# Altium schematic sheet Misc.SchDoc
size A4 portrait; CompanyName: FairWaves LLC; DrawnBy: Andrey Sviyazov; DocumentNumber: 2; Revision: 1; SheetNumber: 2; SheetTotal: 5
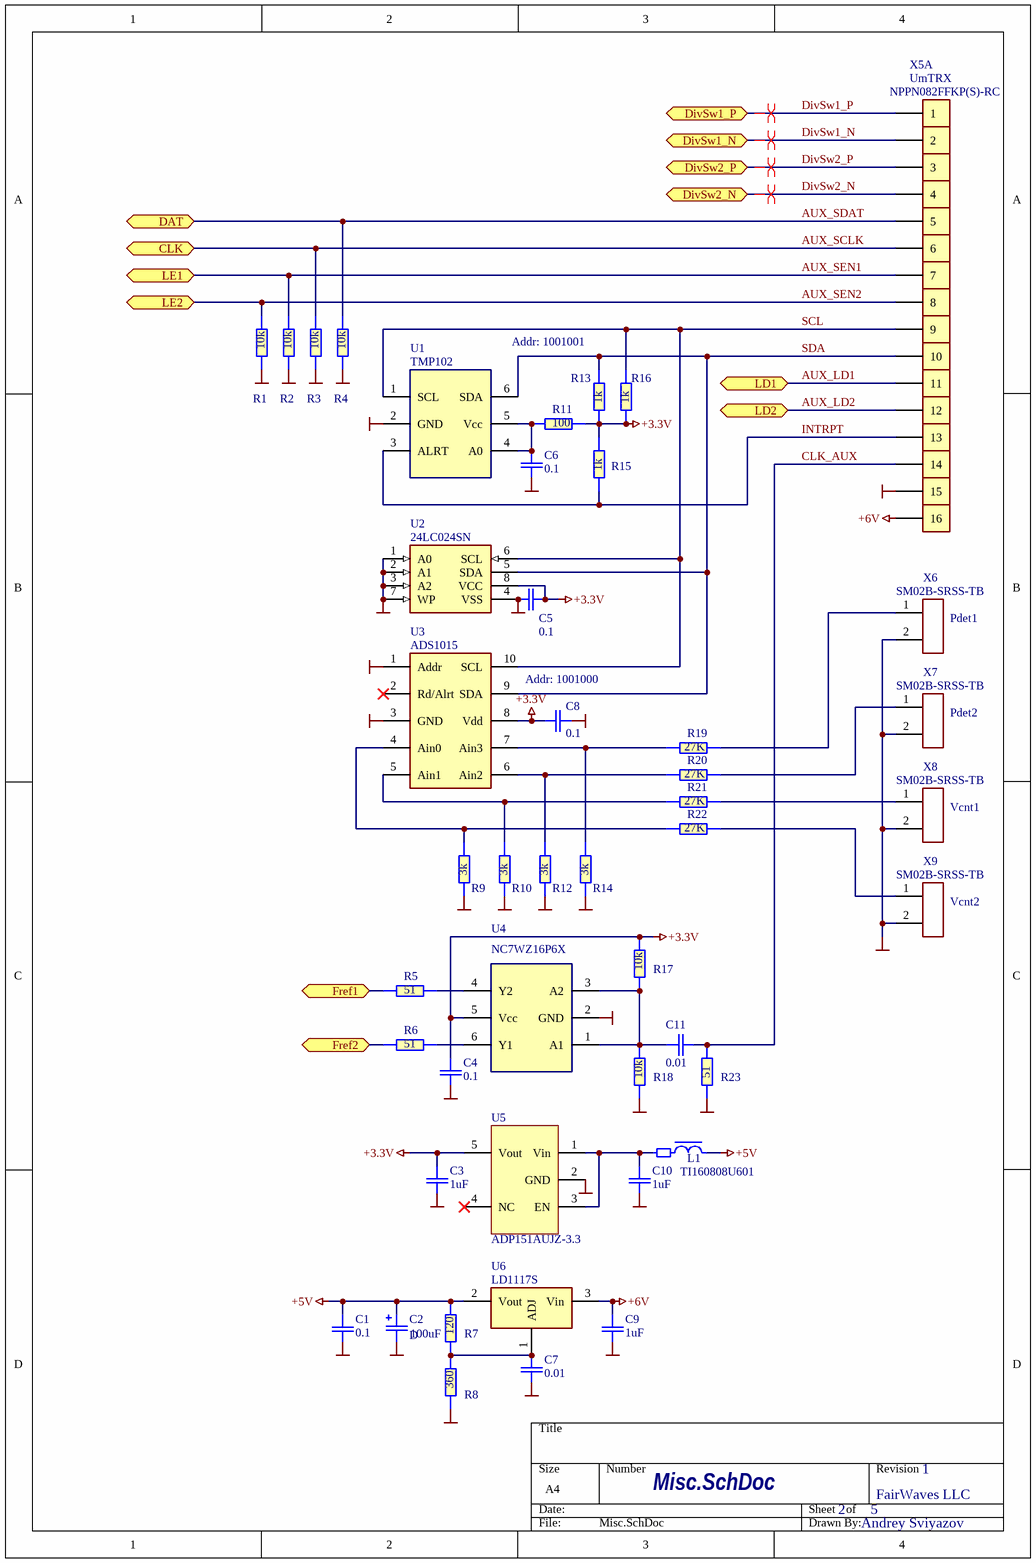
[diagram p0: Misc.SchDoc]

## Parts
C1  0.1  [C0603-Phillips]
C2  100uF  [cd7343]
C3  1uF  [C0603-Phillips]
C4  0.1  [C0603-Phillips]
C5  0.1  [C0603-Phillips]
C6  0.1  [C0603-Phillips]
C7  0.01  [C0603-Phillips]
C8  0.1  [C0603-Phillips]
C9  1uF  [C0603-Phillips]
C10  1uF  [C0603-Phillips]
C11  0.01  [C0603-Phillips]
L1  TI160808U601  [Ti160808-Phillips]
R1  10k  [R0603-PHILLIPS]
R2  10k  [R0603-PHILLIPS]
R3  10k  [R0603-PHILLIPS]
R4  10k  [R0603-PHILLIPS]
R5  51  [R0603-PHILLIPS]
R6  51  [R0603-PHILLIPS]
R7  120  [R0603-PHILLIPS]
R8  360  [R0603-PHILLIPS]
R9  3k  [R0603-PHILLIPS]
R10  3k  [R0603-PHILLIPS]
R11  100  [R0603-PHILLIPS]
R12  3k  [R0603-PHILLIPS]
R13  1k  [R0603-PHILLIPS]
R14  3k  [R0603-PHILLIPS]
R15  1k  [R0603-PHILLIPS]
R16  1k  [R0603-PHILLIPS]
R17  10k  [R0603-PHILLIPS]
R18  10k  [R0603-PHILLIPS]
R19  27K  [R0603-PHILLIPS]
R20  27K  [R0603-PHILLIPS]
R21  27K  [R0603-PHILLIPS]
R22  27K  [R0603-PHILLIPS]
R23  51  [R0603-PHILLIPS]
U1  TMP102  Addr: 1001001  [PDSO-G6]
U2  24LC024SN  [SOIC8]
U3  ADS1015  Addr: 1001000  [TSSOP-SPDSO-G10]
U4  NC7WZ16P6X  [SC70-6LD(SOT363)]
U5  ADP151AUJZ-3.3  [SOT-23-5[3.1x1.8/0.95]]
U6  LD1117S  [SOT-223-1]
X5  NPPN082FFKP(S)-RC  Misc: UmTRX  [NPPN082FFKP(S)]  (parts A,B,C,D,E,F,G,H,I,J,K,L,M,N,O,P of 16)
X6  SM02B-SRSS-TB  Misc: Pdet1  [SM02B-SRSS-TB]
X7  SM02B-SRSS-TB  Misc: Pdet2  [SM02B-SRSS-TB]
X8  SM02B-SRSS-TB  Misc: Vcnt1  [SM02B-SRSS-TB]
X9  SM02B-SRSS-TB  Misc: Vcnt2  [SM02B-SRSS-TB]

## Ports
CLK, DAT, DivSw1_N, DivSw1_P, DivSw2_N, DivSw2_P, Fref1, Fref2, LD1, LD2, LE1, LE2

## Nets
+3.3V: C3.2 C4.2 C5.2 C8.1 R11.2 R13.1 R15.2 R16.1 R17.1 U2.8(VCC) U3.8(Vdd) U4.5(Vcc) U5.5(Vout)
+5V: C1.2 C2.1(+) L1.1 R7.1 U6.2(Vout)
+6V: C9.2 U6.3(Vin) X5.16
GND: C1.1 C2.2(-) C3.1 C4.1 C5.1 C6.1 C7.1 C8.2 C9.1 C10.1 R1.1 R2.1 R3.1 R4.1 R8.2 R9.2 R10.2 R12.2 R14.2 R18.2 R23.2 U1.2(GND) U2.1(A0) U2.2(A1) U2.3(A2) U2.4(VSS) U2.7(WP) U3.1(Addr) U3.3(GND) U4.2(GND) U5.2(GND) X5.15 X6.2 X7.2 X8.2 X9.2
AUX_LD1: X5.11 ; port LD1
AUX_LD2: X5.12 ; port LD2
AUX_SCLK: R3.2 X5.6 ; port CLK
AUX_SDAT: R4.2 X5.5 ; port DAT
AUX_SEN1: R2.2 X5.7 ; port LE1
AUX_SEN2: R1.2 X5.8 ; port LE2
CLK_AUX: C11.1 R23.1 X5.14
DivSw1_N: X5.2 ; port DivSw1_N
DivSw1_P: X5.1 ; port DivSw1_P
DivSw2_N: X5.4 ; port DivSw2_N
DivSw2_P: X5.3 ; port DivSw2_P
Fref1: R5.1 ; port Fref1
Fref2: R6.1 ; port Fref2
INTRPT: R15.1 U1.3(ALRT) X5.13
SCL: R16.2 U1.1(SCL) U2.6(SCL) U3.10(SCL) X5.9
SDA: R13.2 U1.6(SDA) U2.5(SDA) U3.9(SDA) X5.10
NetC6_2: C6.2 R11.1 U1.4(A0) U1.5(Vcc)
NetC7_2: C7.2 R7.2 R8.1 U6.1(ADJ)
NetC10_2: C10.2 L1.2 U5.1(Vin) U5.3(EN)
NetC11_2: C11.2 R17.2 R18.1 U4.1(A1) U4.3(A2)
NetR5_2: R5.2 U4.4(Y2)
NetR6_2: R6.2 U4.6(Y1)
NetR9_1: R9.1 R22.1 U3.4(Ain0)
NetR10_1: R10.1 R21.1 U3.5(Ain1)
NetR12_1: R12.1 R20.1 U3.6(Ain2)
NetR14_1: R14.1 R19.1 U3.7(Ain3)
NetR19_2: R19.2 X6.1
NetR20_2: R20.2 X7.1
NetR21_2: R21.2 X8.1
NetR22_2: R22.2 X9.1

Not connected (* = marked no-connect by the designer): U3 2(Rd/Alrt)*; U5 4(NC)*

## Layout directives
differential pair: DivSw1_N, DivSw1_P, DivSw2_N, DivSw2_P

## Notes on the sheet
- (in symbol CD7343) D

## Library data of the parts
C1 C3-C11 = C0603: Capacitor; Manufacturer: MURATA; Tolerance: 20%; Name: SMD0603; U/P/TKE: Y5V
  C1 C4-C6 C8: Value: 0.1
  C3 C9 C10: Value: 1uF
  C7 C11: Value: 0.01
C2 = CD7343: Capacitor; Manufacturer: SPRAGUE; Name: CASE-D; U/P/TKE: 16V; Value: 100uF
L1 = TI160808: Choke; Manufacturer: MURATA; Name: TI160808U601; Value: *
R1-R8 R11 R13 R15-R18 R23 = R0603: Resistor; Manufacturer: YAGEO; Tolerance: 5%; Name: SMD0603; U/P/TKE: 0.1W
  R1-R4 R17 R18: Value: 10k
  R5 R6 R23: Value: 51
  R7: Value: 120
  R8: Value: 360
  R11: Value: 100
  R13 R15 R16: Value: 1k
R9 R10 R12 R14 R19-R22 = R0603: Resistor; Manufacturer: YAGEO; Tolerance: 1%; Name: SMD0603; U/P/TKE: 0.1W
  R9 R10 R12 R14: Value: 3k
  R19-R22: Value: 27K
U1 = TMP102: IC; Manufacturer: TI; Misc: Temperature Sensor I2C; Name: TMP102
U2 = AT24CXX: EEPROM; Manufacturer: Microchip; Swap: No; Name: 24LC024SN
U3 = ADS1015: IC; Manufacturer: TI; Swap: No; Name: ADS1015
U4 = NC7WZ16P6X: IC; Manufacturer: Fairchild; Name: NC7WZ16P6X
U5 = ADP151AUJZ: IC; Manufacturer: AD; Name: ADP151AUJZ-3.3
U6 = LD1117ADJ: IC; Manufacturer: STMicro; Swap: No; Name: LD1117S
X5 = NPPN082FFKP(S): Connector female 2mm SMD; Manufacturer: Sullins; Name: NPPN082FFKP(S)-RC
X6-X9 = SM02B-SRSS-TB: Connector; Manufacturer: JST; Name: SM02B-SRSS-TB